# Altium schematic sheet 02-Insence_interface.SchDoc
size C; SheetNumber: 2
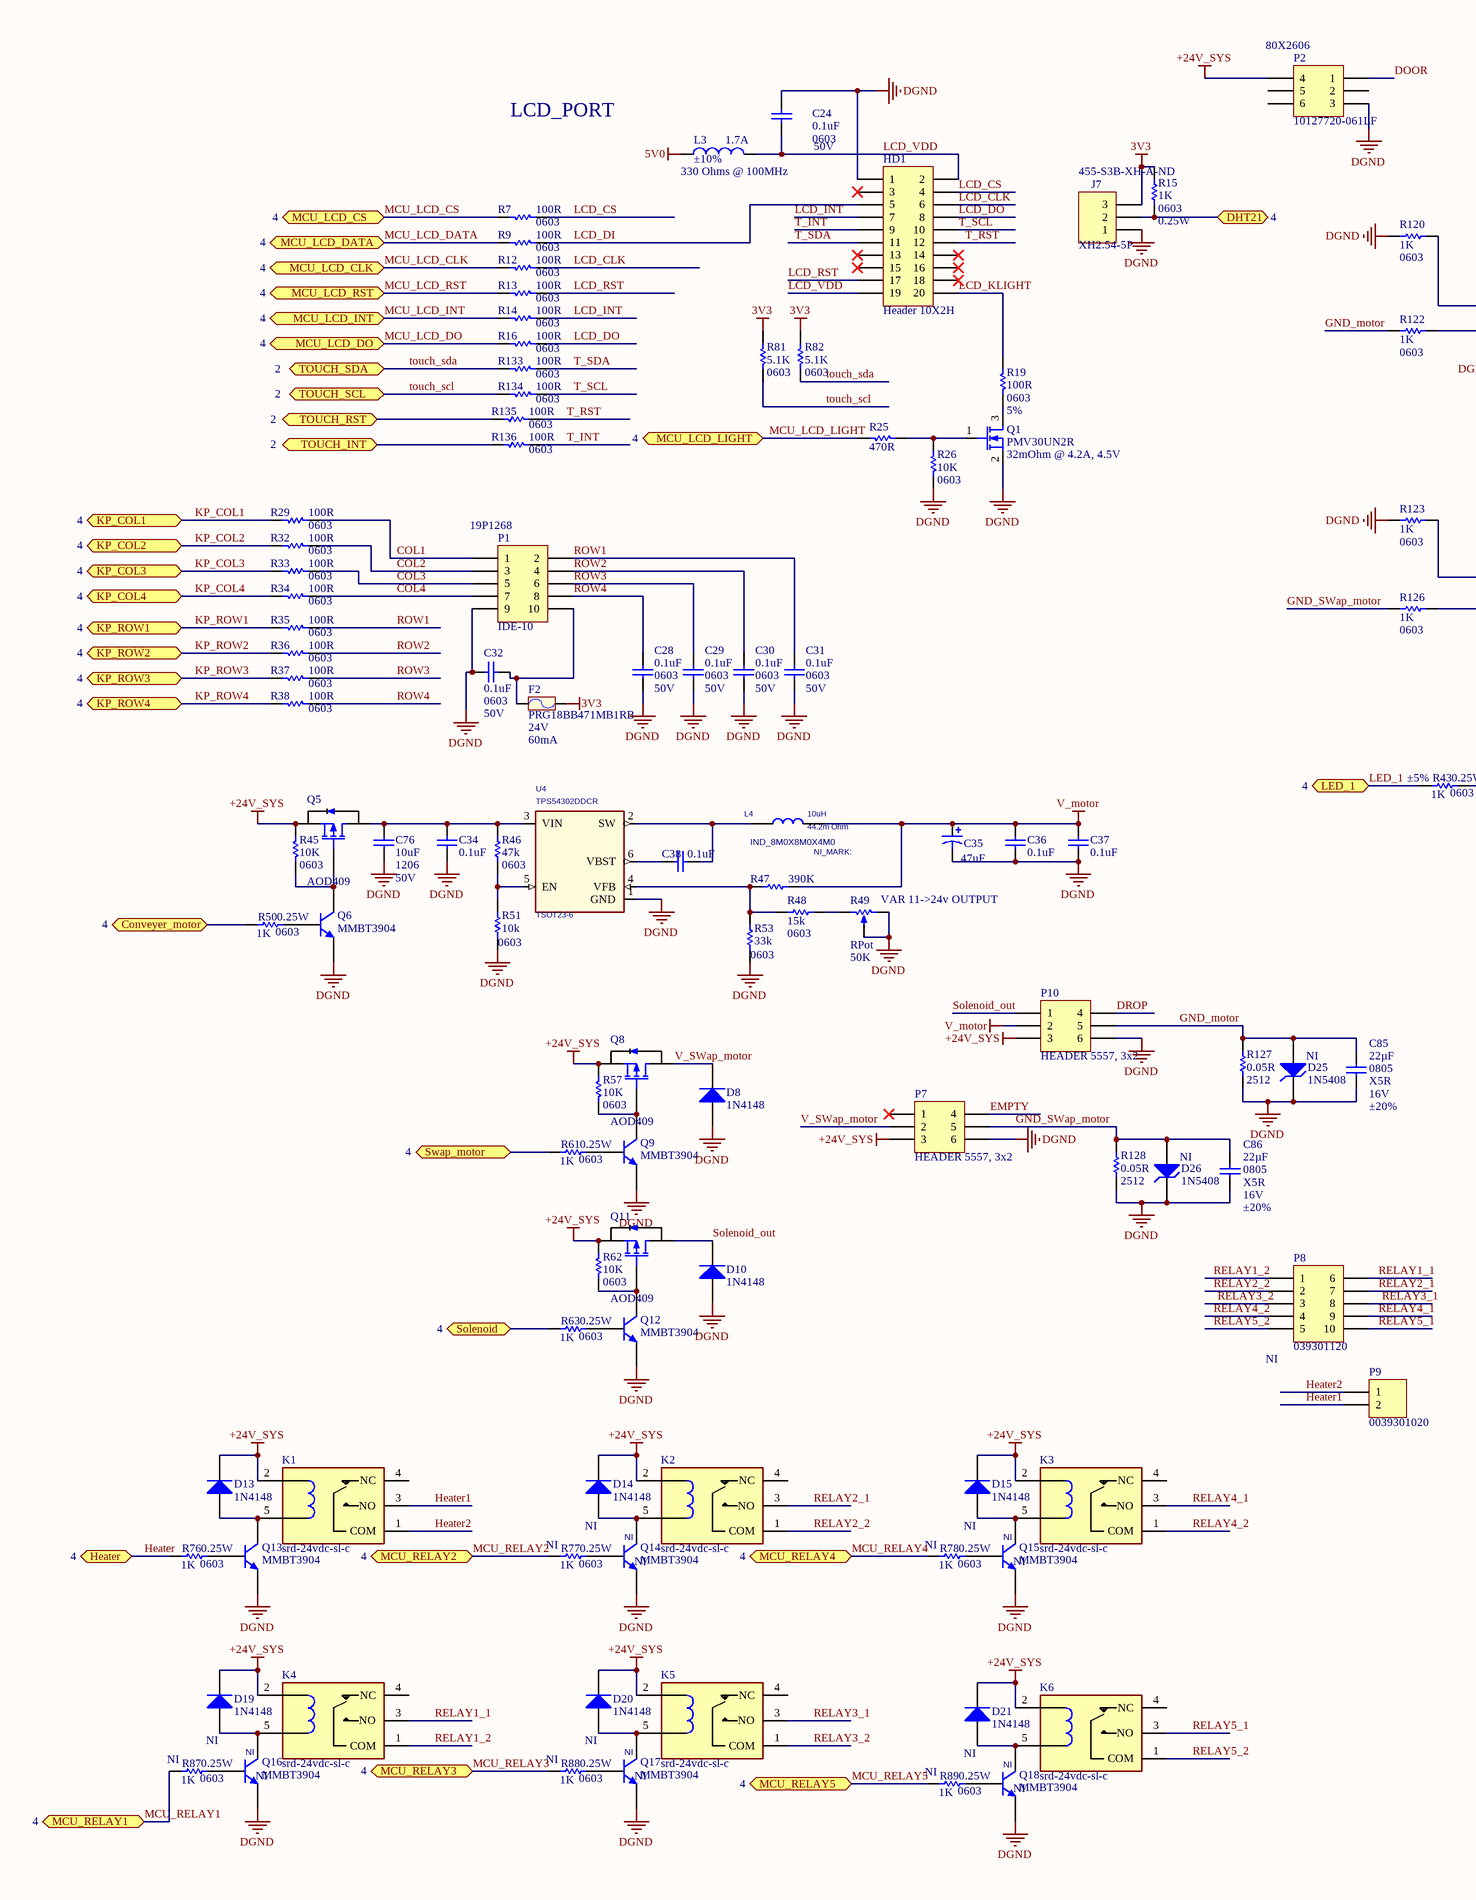
[diagram p0: 02-Insence_interface.SchDoc, left]
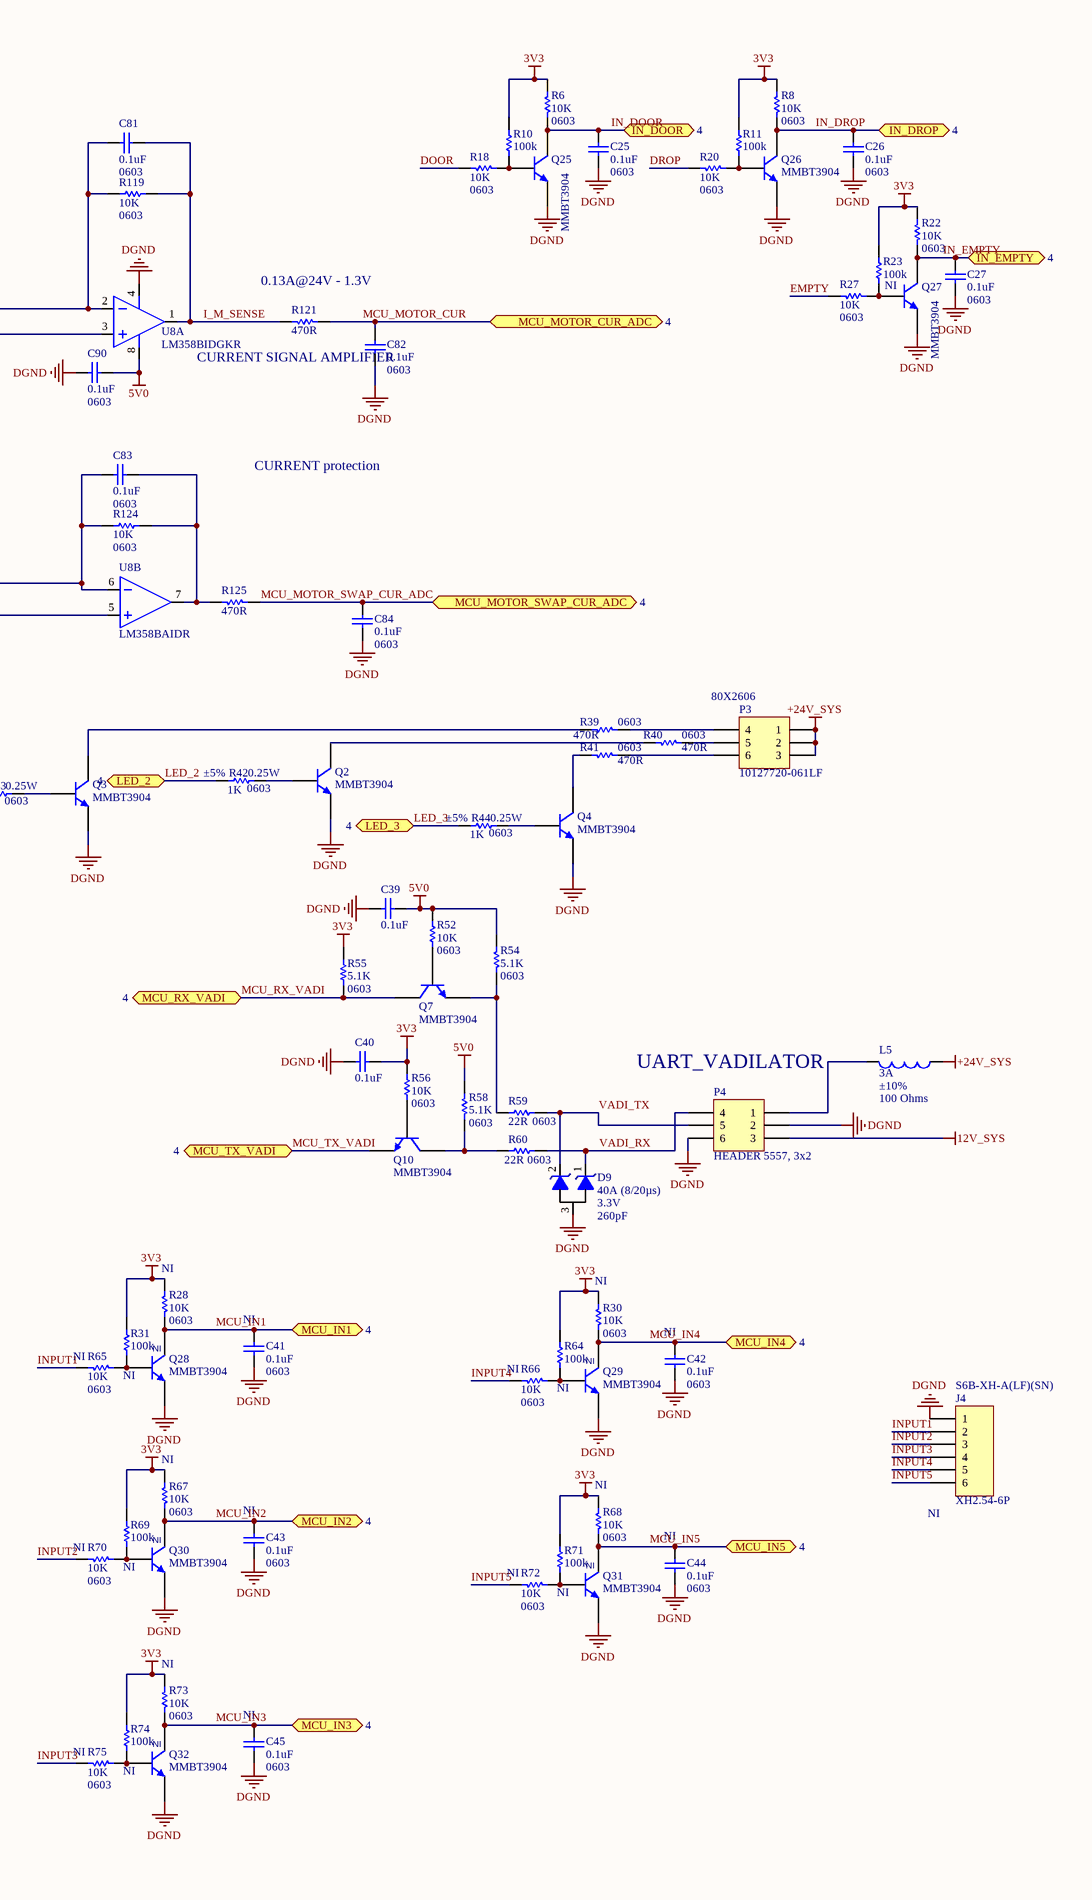
[diagram p1: 02-Insence_interface.SchDoc, right]

## Parts
C24  FOOTPRINT: 0603  Voltage: 50V  [CAP 0603]  (hidden comment: 0.1uF)
C25  FOOTPRINT: 0603  [CAP 0603]  (hidden comment: 0.1uF)
C26  FOOTPRINT: 0603  [CAP 0603]  (hidden comment: 0.1uF)
C27  FOOTPRINT: 0603  [CAP 0603]  (hidden comment: 0.1uF)
C28  FOOTPRINT: 0603  Voltage: 50V  [CAP 0603]  (hidden comment: 0.1uF)
C29  FOOTPRINT: 0603  Voltage: 50V  [CAP 0603]  (hidden comment: 0.1uF)
C30  FOOTPRINT: 0603  Voltage: 50V  [CAP 0603]  (hidden comment: 0.1uF)
C31  FOOTPRINT: 0603  Voltage: 50V  [CAP 0603]  (hidden comment: 0.1uF)
C32  FOOTPRINT: 0603  Voltage: 50V  [CAP 0603]  (hidden comment: 0.1uF)
C34  =Value: 0.1uF  [0805]  (hidden comment: Cap)
C35  47uF  [CAP ALUM SMD-D Package 6.3x5.4mm]
C36  =Value: 0.1uF  [0805]  (hidden comment: Cap)
C37  =Value: 0.1uF  [0805]  (hidden comment: Cap)
C38  =Value: 0.1uF  [cap 0603]  (hidden comment: Cap)
C39  0.1uF  [CAP 0603]
C40  0.1uF  [CAP 0603]
C41  FOOTPRINT: 0603  NI_MARK: NI  [CAP 0603]  (hidden comment: 0.1uF)
C42  FOOTPRINT: 0603  NI_MARK: NI  [CAP 0603]  (hidden comment: 0.1uF)
C43  FOOTPRINT: 0603  NI_MARK: NI  [CAP 0603]  (hidden comment: 0.1uF)
C44  FOOTPRINT: 0603  NI_MARK: NI  [CAP 0603]  (hidden comment: 0.1uF)
C45  FOOTPRINT: 0603  NI_MARK: NI  [CAP 0603]  (hidden comment: 0.1uF)
C76  FOOTPRINT: 1206  Voltage: 50V  [CAP 1206]  (hidden comment: 10uF)
C81  FOOTPRINT: 0603  [CAP 0603]  (hidden comment: 0.1uF)
C82  FOOTPRINT: 0603  [CAP 0603]  (hidden comment: 0.1uF)
C83  FOOTPRINT: 0603  [CAP 0603]  (hidden comment: 0.1uF)
C84  FOOTPRINT: 0603  [CAP 0603]  (hidden comment: 0.1uF)
C85  Package: 0805  Voltage: 16V  Tolerance: ±20%  Material: X5R  [CAP 0805]  (hidden comment: 22µF)
C86  Package: 0805  Voltage: 16V  Tolerance: ±20%  Material: X5R  [CAP 0805]  (hidden comment: 22µF)
C90  FOOTPRINT: 0603  [CAP 0603]  (hidden comment: 0.1uF)
D8  1N4148  [diode_1206]
D9  CURRENT: 40A (8/20µs)  VOLTAGE: 3.3V  Junction Capacitance: 260pF  [SOT-23-3]  (hidden comment: SM3.3H-TP)
D10  1N4148  [diode_1206]
D13  1N4148  [diode_1206]
D14  1N4148  NI_MARK: NI  [diode_1206]
D15  1N4148  NI_MARK: NI  [diode_1206]
D19  1N4148  NI_MARK: NI  [diode_1206]
D20  1N4148  NI_MARK: NI  [diode_1206]
D21  1N4148  NI_MARK: NI  [diode_1206]
D25  1N5408  NI_MARK: NI  [SMB]
D26  1N5408  NI_MARK: NI  [SMB]
F2  PRG18BB471MB1RB  Voltage - Rated: 24V  Current Rating (Amps): 60mA  [FB 0603]
HD1  Header 10X2H  [IDE_20-RA]
J4  XH2.54-6P  Supplier Part Number 1: S6B-XH-A(LF)(SN)  NI_MARK: NI  [XH2.54-6P-RA]
J7  XH2.54-5P  Supplier Part Number 1: 455-S3B-XH-A-ND  [XH2.54-3P-RA]
K1  srd-24vdc-sl-c  [srd24vdcslc]
K2  srd-24vdc-sl-c  NI_MARK: NI  [srd24vdcslc]
K3  srd-24vdc-sl-c  NI_MARK: NI  [srd24vdcslc]
K4  srd-24vdc-sl-c  NI_MARK: NI  [srd24vdcslc]
K5  srd-24vdc-sl-c  NI_MARK: NI  [srd24vdcslc]
K6  srd-24vdc-sl-c  NI_MARK: NI  [srd24vdcslc]
L3  Current: 1.7A  Tolerance: ±10%  [FB 0603]  (hidden comment: 330 Ohms @ 100MHz)
L4  10uH  PACKAGE: IND_8M0X8M0X4M0  DCR: 44.2m Ohm  [IND 8x8MM]
L5  value 100 Ohms  Current: 3A  Tolerance: ±10%  [FB 0603]  (hidden comment: MPZ1608S101ATAH0)
P1  IDE-10  Supplier Part Number 1: 19P1268  [IDE-10-RA]
P2  10127720-061LF  Supplier Part Number 1: 80X2606  [PHM-3x2H 3.0 - RA]
P3  10127720-061LF  Supplier Part Number 1: 80X2606  [PHM-3x2H 3.0 - RA]
P4  HEADER 5557, 3x2  [HDR2x3 4_2MM FEMALE TH RA]
P7  HEADER 5557, 3x2  [HDR2x3 4_2MM FEMALE TH RA]
P8  039301120  NI_MARK: NI  [HDR2x5 4_2MM FEMALE TH RA]
P9  0039301020  [HDR2x1 4_2MM FEMALE TH RA]
P10  HEADER 5557, 3x2  [HDR2x3 4_2MM FEMALE TH RA]
Q1  PMV30UN2R  RDSON: 32mOhm @ 4.2A, 4.5V  [SOT-23-3]
Q2  MMBT3904  [SOT-23]
Q3  MMBT3904  [SOT-23]
Q4  MMBT3904  [SOT-23]
Q5  AOD409  [TO-252]
Q6  MMBT3904  [SOT-23]
Q7  MMBT3904  [SOT-23]
Q8  AOD409  [TO-252]
Q9  MMBT3904  [SOT-23]
Q10  MMBT3904  [SOT-23]
Q11  AOD409  [TO-252]
Q12  MMBT3904  [SOT-23]
Q13  MMBT3904  [SOT-23]
Q14  MMBT3904  NI_MARK: NI  [SOT-23]
Q15  MMBT3904  NI_MARK: NI  [SOT-23]
Q16  MMBT3904  NI_MARK: NI  [SOT-23]
Q17  MMBT3904  NI_MARK: NI  [SOT-23]
Q18  MMBT3904  NI_MARK: NI  [SOT-23]
Q25  MMBT3904  [SOT-23]
Q26  MMBT3904  [SOT-23]
Q27  MMBT3904  [SOT-23]
Q28  MMBT3904  NI_MARK: NI  [SOT-23]
Q29  MMBT3904  NI_MARK: NI  [SOT-23]
Q30  MMBT3904  NI_MARK: NI  [SOT-23]
Q31  MMBT3904  NI_MARK: NI  [SOT-23]
Q32  MMBT3904  NI_MARK: NI  [SOT-23]
R6  PCB Footprint: 0603  [res 0603]  (hidden comment: 10K)
R7  PCB_ Footprint: 0603  [res 0603]  (hidden comment: 100R)
R8  PCB Footprint: 0603  [res 0603]  (hidden comment: 10K)
R9  PCB_ Footprint: 0603  [res 0603]  (hidden comment: 100R)
R10  value 100k  [RES 0603]  (hidden comment: 100k, 0603)
R11  value 100k  [RES 0603]  (hidden comment: 100k, 0603)
R12  PCB_ Footprint: 0603  [res 0603]  (hidden comment: 100R)
R13  PCB_ Footprint: 0603  [res 0603]  (hidden comment: 100R)
R14  PCB_ Footprint: 0603  [res 0603]  (hidden comment: 100R)
R15  PCB Footprint: 0603  Power: 0.25W  [res 0603]  (hidden comment: 1K)
R16  PCB_ Footprint: 0603  [res 0603]  (hidden comment: 100R)
R18  PCB Footprint: 0603  [res 0603]  (hidden comment: 10K)
R19  PCB_ Footprint: 0603  Tolerance: 5%  [res 0603]  (hidden comment: 100R)
R20  PCB Footprint: 0603  [res 0603]  (hidden comment: 10K)
R22  PCB Footprint: 0603  [res 0603]  (hidden comment: 10K)
R23  value 100k  Assembly: NI  [RES 0603]  (hidden comment: 100k, 0603)
R25  470R  [res 0603]
R26  PCB Footprint: 0603  [res 0603]  (hidden comment: 10K)
R27  PCB Footprint: 0603  [res 0603]  (hidden comment: 10K)
R28  NI_MARK: NI  PCB Footprint: 0603  [res 0603]  (hidden comment: 10K)
R29  PCB_ Footprint: 0603  [res 0603]  (hidden comment: 100R)
R30  NI_MARK: NI  PCB Footprint: 0603  [res 0603]  (hidden comment: 10K)
R31  value 100k  NI_MARK: NI  [RES 0603]  (hidden comment: 100k, 0603)
R32  PCB_ Footprint: 0603  [res 0603]  (hidden comment: 100R)
R33  PCB_ Footprint: 0603  [res 0603]  (hidden comment: 100R)
R34  PCB_ Footprint: 0603  [res 0603]  (hidden comment: 100R)
R35  PCB_ Footprint: 0603  [res 0603]  (hidden comment: 100R)
R36  PCB_ Footprint: 0603  [res 0603]  (hidden comment: 100R)
R37  PCB_ Footprint: 0603  [res 0603]  (hidden comment: 100R)
R38  PCB_ Footprint: 0603  [res 0603]  (hidden comment: 100R)
R39  PCB Footprint: 0603  [res 0603]  (hidden comment: 470R)
R40  PCB Footprint: 0603  [res 0603]  (hidden comment: 470R)
R41  PCB Footprint: 0603  [res 0603]  (hidden comment: 470R)
R42  PCB Footprint: 0603  Power: 0.25W  Tolerance: ±5%  [res 0603]  (hidden comment: 1K)
R43  PCB Footprint: 0603  Power: 0.25W  Tolerance: ±5%  [res 0603]  (hidden comment: 1K)
R44  PCB Footprint: 0603  Power: 0.25W  Tolerance: ±5%  [res 0603]  (hidden comment: 1K)
R45  PCB Footprint: 0603  [res 0603]  (hidden comment: 10K)
R46  value 47k  Footprint: 0603  [res 0603]  (hidden comment: Res1)
R47  value 390K  [res 0603]  (hidden comment: Res1)
R48  value 15k  Footprint: 0603  [res 0603]  (hidden comment: Res1)
R49  RPot  value 50K  [R_POT_RA]
R50  PCB Footprint: 0603  Power: 0.25W  [res 0603]  (hidden comment: 1K)
R51  value 10k  Footprint: 0603  [res 0603]  (hidden comment: Res1)
R52  PCB Footprint: 0603  [res 0603]  (hidden comment: 10K)
R53  value 33k  Footprint: 0603  [res 0603]  (hidden comment: Res1)
R54  PCB Footprint: 0603  [res 0603]  (hidden comment: 5.1K)
R55  PCB Footprint: 0603  [res 0603]  (hidden comment: 5.1K)
R56  PCB Footprint: 0603  [res 0603]  (hidden comment: 10K)
R57  PCB Footprint: 0603  [res 0603]  (hidden comment: 10K)
R58  PCB Footprint: 0603  [res 0603]  (hidden comment: 5.1K)
R59  PCB Footprint: 0603  [res 0603]  (hidden comment: 22R)
R60  PCB Footprint: 0603  [res 0603]  (hidden comment: 22R)
R61  PCB Footprint: 0603  Power: 0.25W  [res 0603]  (hidden comment: 1K)
R62  PCB Footprint: 0603  [res 0603]  (hidden comment: 10K)
R63  PCB Footprint: 0603  Power: 0.25W  [res 0603]  (hidden comment: 1K)
R64  value 100k  NI_MARK: NI  [RES 0603]  (hidden comment: 100k, 0603)
R65  NI_MARK: NI  PCB Footprint: 0603  [res 0603]  (hidden comment: 10K)
R66  NI_MARK: NI  PCB Footprint: 0603  [res 0603]  (hidden comment: 10K)
R67  NI_MARK: NI  PCB Footprint: 0603  [res 0603]  (hidden comment: 10K)
R68  NI_MARK: NI  PCB Footprint: 0603  [res 0603]  (hidden comment: 10K)
R69  value 100k  NI_MARK: NI  [RES 0603]  (hidden comment: 100k, 0603)
R70  NI_MARK: NI  PCB Footprint: 0603  [res 0603]  (hidden comment: 10K)
R71  value 100k  NI_MARK: NI  [RES 0603]  (hidden comment: 100k, 0603)
R72  NI_MARK: NI  PCB Footprint: 0603  [res 0603]  (hidden comment: 10K)
R73  NI_MARK: NI  PCB Footprint: 0603  [res 0603]  (hidden comment: 10K)
R74  value 100k  NI_MARK: NI  [RES 0603]  (hidden comment: 100k, 0603)
R75  NI_MARK: NI  PCB Footprint: 0603  [res 0603]  (hidden comment: 10K)
R76  PCB Footprint: 0603  Power: 0.25W  [res 0603]  (hidden comment: 1K)
R77  NI_MARK: NI  PCB Footprint: 0603  Power: 0.25W  [res 0603]  (hidden comment: 1K)
R78  NI_MARK: NI  PCB Footprint: 0603  Power: 0.25W  [res 0603]  (hidden comment: 1K)
R81  PCB Footprint: 0603  [res 0603]  (hidden comment: 5.1K)
R82  PCB Footprint: 0603  [res 0603]  (hidden comment: 5.1K)
R87  NI_MARK: NI  PCB Footprint: 0603  Power: 0.25W  [res 0603]  (hidden comment: 1K)
R88  NI_MARK: NI  PCB Footprint: 0603  Power: 0.25W  [res 0603]  (hidden comment: 1K)
R89  NI_MARK: NI  PCB Footprint: 0603  Power: 0.25W  [res 0603]  (hidden comment: 1K)
R119  PCB Footprint: 0603  [res 0603]  (hidden comment: 10K)
R120  PCB Footprint: 0603  [res 0603]  (hidden comment: 1K)
R121  470R  [res 0603]
R122  PCB Footprint: 0603  [res 0603]  (hidden comment: 1K)
R123  PCB Footprint: 0603  [res 0603]  (hidden comment: 1K)
R124  PCB Footprint: 0603  [res 0603]  (hidden comment: 10K)
R125  470R  [res 0603]
R126  PCB Footprint: 0603  [res 0603]  (hidden comment: 1K)
R127  value 0.05R  PCB Footprint: 2512  [res 2512]  (hidden comment: CR2512-F/-1R00ELF)
R128  value 0.05R  PCB Footprint: 2512  [res 2512]  (hidden comment: CR2512-F/-1R00ELF)
R133  PCB_ Footprint: 0603  [res 0603]  (hidden comment: 100R)
R134  PCB_ Footprint: 0603  [res 0603]  (hidden comment: 100R)
R135  PCB_ Footprint: 0603  [res 0603]  (hidden comment: 100R)
R136  PCB_ Footprint: 0603  [res 0603]  (hidden comment: 100R)
U4  TPS54302DDCR  PACKAGE: TSOT23-6  [SOT23-6]
U8  LM358BIDGKR  [SOIC-8]  (parts A,B of 2)

## Ports
Conveyer_motor (bidir, see 4), DHT21 (bidir, see 4), Heater (bidir, see 4), IN_DOOR (bidir, see 4), IN_DROP (bidir, see 4), IN_EMPTY (bidir, see 4), KP_COL1 (bidir, see 4), KP_COL2 (bidir, see 4), KP_COL3 (bidir, see 4), KP_COL4 (bidir, see 4), KP_ROW1 (bidir, see 4), KP_ROW2 (bidir, see 4), KP_ROW3 (bidir, see 4), KP_ROW4 (bidir, see 4), LED_1 (bidir, see 4), LED_2 (bidir, see 4), LED_3 (bidir, see 4), MCU_IN1 (bidir, see 4), MCU_IN2 (bidir, see 4), MCU_IN3 (bidir, see 4), MCU_IN4 (bidir, see 4), MCU_IN5 (bidir, see 4), MCU_LCD_CLK (bidir, see 4), MCU_LCD_CS (bidir, see 4), MCU_LCD_DATA (bidir, see 4), MCU_LCD_DO (bidir, see 4), MCU_LCD_INT (bidir, see 4), MCU_LCD_LIGHT (bidir, see 4), MCU_LCD_RST (bidir, see 4), MCU_MOTOR_CUR_ADC (bidir, see 4), MCU_MOTOR_SWAP_CUR_ADC (bidir, see 4), MCU_RELAY1 (bidir, see 4), MCU_RELAY2 (bidir, see 4), MCU_RELAY3 (bidir, see 4), MCU_RELAY4 (bidir, see 4), MCU_RELAY5 (bidir, see 4), MCU_RX_VADI (bidir, see 4), MCU_TX_VADI (bidir, see 4), Solenoid (bidir, see 4), Swap_motor (bidir, see 4), TOUCH_INT (bidir, see 2), TOUCH_RST (bidir, see 2), TOUCH_SCL (bidir, see 2), TOUCH_SDA (bidir, see 2)

## Nets
3V3: C40.2 F2.1 J7.3 R6.1 R8.1 R10.2 R11.2 R15.2 R22.1 R23.2 R28.1 R30.1 R31.2 R55.1 R56.1 R64.2 R67.1 R68.1 R69.2 R71.2 R73.1 R74.2 R81.1 R82.1
5V0: C39.1 C90.1 L3.1 R52.1 R54.1 R58.1 U8.8(+V)
12V_SYS: P4.3
+24V_SYS: D13.2(K) D14.2(K) D15.2(K) D19.2(K) D20.2(K) D21.2(K) K1.2(COIL_1) K2.2(COIL_1) K3.2(COIL_1) K4.2(COIL_1) K5.2(COIL_1) K6.2(COIL_1) L5.1 P2.4 P3.1 P3.2 P3.3 P7.3 P10.3 Q5.3(S) Q8.3(S) Q11.3(S) R45.1 R57.1 R62.1
DGND: C24.1 C25.1 C26.1 C27.1 C28.1 C29.1 C30.1 C31.1 C32.1 C34.1 C35.2 C36.1 C37.1 C39.2 C40.1 C41.1 C42.1 C43.1 C44.1 C45.1 C76.1 C82.1 C84.1 C85.2 C86.2 C90.2 D8.1(A) D9.3(A) D10.1(A) D25.2(K) D26.2(K) HD1.1 J4.1 J7.1 P1.9 P2.3 P4.2 P4.6 P7.6 P10.6 Q1.2(S) Q2.2(E) Q3.2(E) Q4.2(E) Q6.2(E) Q9.2(E) Q12.2(E) Q13.2(E) Q14.2(E) Q15.2(E) Q16.2(E) Q17.2(E) Q18.2(E) Q25.2(E) Q26.2(E) Q27.2(E) Q28.2(E) Q29.2(E) Q30.2(E) Q31.2(E) Q32.2(E) R26.2 R49.1(TOP) R49.3(TAP) R51.2 R53.2 R120.2 R123.2 R127.2 R128.2 U4.1(GND) U8.4(-V)
V_motor: C35.1 C36.2 C37.2 L4.2(B) P10.2 R47.2
COL1: P1.1 R29.2
COL2: P1.3 R32.2
COL3: P1.5 R33.2
COL4: P1.7 R34.2
Conveyer_motor: R50.2 ; port Conveyer_motor
DHT21: J7.2 R15.1 ; port DHT21
DOOR: P2.1 R18.1
DROP: P10.4 R20.1
EMPTY: P7.4 R27.1
GND_motor: C85.1 D25.1(A) P10.5 R122.2 R127.1
GND_SWap_motor: C86.1 D26.1(A) P7.5 R126.2 R128.1
Heater: R76.2 ; port Heater
Heater1: K1.3(NO) P9.2
Heater2: K1.1(COM) P9.1
I_M_SENSE: C81.1 R119.2 R121.1 U8.1(OUT)
IN_DOOR: C25.2 Q25.3(C) R6.2 ; port IN_DOOR
IN_DROP: C26.2 Q26.3(C) R8.2 ; port IN_DROP
IN_EMPTY: C27.2 Q27.3(C) R22.2 ; port IN_EMPTY
INPUT1: J4.2 R65.1
INPUT2: J4.3 R70.1
INPUT3: J4.4 R75.1
INPUT4: J4.5 R66.1
INPUT5: J4.6 R72.1
KP_COL1: R29.1 ; port KP_COL1
KP_COL2: R32.1 ; port KP_COL2
KP_COL3: R33.1 ; port KP_COL3
KP_COL4: R34.1 ; port KP_COL4
KP_ROW1: R35.1 ; port KP_ROW1
KP_ROW2: R36.1 ; port KP_ROW2
KP_ROW3: R37.1 ; port KP_ROW3
KP_ROW4: R38.1 ; port KP_ROW4
LCD_CLK: HD1.6 R12.2
LCD_CS: HD1.4 R7.2
LCD_DI: HD1.5 R9.2
LCD_DO: HD1.8 R16.2
LCD_INT: HD1.7 R14.2
LCD_KLIGHT: HD1.20 R19.1
LCD_RST: HD1.17 R13.2
LCD_VDD: C24.2 HD1.2 HD1.19 L3.2
LED_1: R43.2 ; port LED_1
LED_2: R42.2 ; port LED_2
LED_3: R44.2 ; port LED_3
MCU_IN1: C41.2 Q28.3(C) R28.2 ; port MCU_IN1
MCU_IN2: C43.2 Q30.3(C) R67.2 ; port MCU_IN2
MCU_IN3: C45.2 Q32.3(C) R73.2 ; port MCU_IN3
MCU_IN4: C42.2 Q29.3(C) R30.2 ; port MCU_IN4
MCU_IN5: C44.2 Q31.3(C) R68.2 ; port MCU_IN5
MCU_LCD_CLK: R12.1 ; port MCU_LCD_CLK
MCU_LCD_CS: R7.1 ; port MCU_LCD_CS
MCU_LCD_DATA: R9.1 ; port MCU_LCD_DATA
MCU_LCD_DO: R16.1 ; port MCU_LCD_DO
MCU_LCD_INT: R14.1 ; port MCU_LCD_INT
MCU_LCD_LIGHT: R25.2 ; port MCU_LCD_LIGHT
MCU_LCD_RST: R13.1 ; port MCU_LCD_RST
MCU_MOTOR_CUR: C82.2 R121.2 ; port MCU_MOTOR_CUR_ADC
MCU_MOTOR_SWAP_CUR_ADC: C84.2 R125.1 ; port MCU_MOTOR_SWAP_CUR_ADC
MCU_RELAY1: R87.2 ; port MCU_RELAY1
MCU_RELAY2: R77.2 ; port MCU_RELAY2
MCU_RELAY3: R88.2 ; port MCU_RELAY3
MCU_RELAY4: R78.2 ; port MCU_RELAY4
MCU_RELAY5: R89.2 ; port MCU_RELAY5
MCU_RX_VADI: Q7.3(C) R55.2 ; port MCU_RX_VADI
MCU_TX_VADI: Q10.2(E) ; port MCU_TX_VADI
RELAY1_1: K4.3(NO) P8.6
RELAY1_2: K4.1(COM) P8.1
RELAY2_1: K2.3(NO) P8.7
RELAY2_2: K2.1(COM) P8.2
RELAY3_1: K5.3(NO) P8.8
RELAY3_2: K5.1(COM) P8.3
RELAY4_1: K3.3(NO) P8.9
RELAY4_2: K3.1(COM) P8.4
RELAY5_1: K6.3(NO) P8.10
RELAY5_2: K6.1(COM) P8.5
ROW1: C31.2 P1.2 R35.2
ROW2: C30.2 P1.4 R36.2
ROW3: C29.2 P1.6 R37.2
ROW4: C28.2 P1.8 R38.2
Solenoid: R63.2 ; port Solenoid
Solenoid_out: D10.2(K) P10.1 Q11.2(D)
Swap_motor: R61.2 ; port Swap_motor
T_INT: HD1.9 R136.2
T_RST: HD1.12 R135.2
T_SCL: HD1.10 R134.2
T_SDA: HD1.11 R133.2
TOUCH_INT: R136.1 ; port TOUCH_INT
TOUCH_RST: R135.1 ; port TOUCH_RST
touch_scl: R81.2 R134.1 ; port TOUCH_SCL
touch_sda: R82.2 R133.1 ; port TOUCH_SDA
V_SWap_motor: D8.2(K) P7.2 Q8.2(D)
VADI_RX: D9.1(K) P4.4 R60.2
VADI_TX: D9.2(K) P4.5 R59.2
NetC32_2: C32.2 F2.2 P1.10
NetC34_2: C34.2 C76.2 Q5.2(D) R46.2 U4.3(VIN)
NetC38_1: C38.1 U4.6(VBST)
NetC38_2: C38.2 L4.1(A) U4.2(SW)
NetC81_2: C81.2 R119.1 R120.1 U8.2(IN-)
NetC83_1: C83.1 R124.2 R125.2 U8.7(OUT)
NetC83_2: C83.2 R123.1 R124.1 U8.6(IN-)
NetD13_1: D13.1(A) K1.5(COIL_2) Q13.3(C)
NetD14_1: D14.1(A) K2.5(COIL_2) Q14.3(C)
NetD15_1: D15.1(A) K3.5(COIL_2) Q15.3(C)
NetD19_1: D19.1(A) K4.5(COIL_2) Q16.3(C)
NetD20_1: D20.1(A) K5.5(COIL_2) Q17.3(C)
NetD21_1: D21.1(A) K6.5(COIL_2) Q18.3(C)
NetL5_2: L5.2 P4.1
NetP3_4: P3.4 R39.1
NetP3_5: P3.5 R40.1
NetP3_6: P3.6 R41.1
NetQ1_1: Q1.1(G) R25.1 R26.1
NetQ1_3: Q1.3(D) R19.2
NetQ2_1: Q2.1(B) R42.1
NetQ2_3: Q2.3(C) R40.2
NetQ3_1: Q3.1(B) R43.1
NetQ3_3: Q3.3(C) R39.2
NetQ4_1: Q4.1(B) R44.1
NetQ4_3: Q4.3(C) R41.2
NetQ5_1: Q5.1(G) Q6.3(C) R45.2
NetQ6_1: Q6.1(B) R50.1
NetQ7_1: Q7.1(B) R52.2
NetQ7_2: Q7.2(E) R54.2 R59.1
NetQ8_1: Q8.1(G) Q9.3(C) R57.2
NetQ9_1: Q9.1(B) R61.1
NetQ10_1: Q10.1(B) R56.2
NetQ10_3: Q10.3(C) R58.2 R60.1
NetQ11_1: Q11.1(G) Q12.3(C) R62.2
NetQ12_1: Q12.1(B) R63.1
NetQ13_1: Q13.1(B) R76.1
NetQ14_1: Q14.1(B) R77.1
NetQ15_1: Q15.1(B) R78.1
NetQ16_1: Q16.1(B) R87.1
NetQ17_1: Q17.1(B) R88.1
NetQ18_1: Q18.1(B) R89.1
NetQ25_1: Q25.1(B) R10.1 R18.2
NetQ26_1: Q26.1(B) R11.1 R20.2
NetQ27_1: Q27.1(B) R23.1 R27.2
NetQ28_1: Q28.1(B) R31.1 R65.2
NetQ29_1: Q29.1(B) R64.1 R66.2
NetQ30_1: Q30.1(B) R69.1 R70.2
NetQ31_1: Q31.1(B) R71.1 R72.2
NetQ32_1: Q32.1(B) R74.1 R75.2
NetR46_1: R46.1 R51.1 U4.5(EN)
NetR47_1: R47.1 R48.1 R53.1 U4.4(VFB)
NetR48_2: R48.2 R49.2(BOT)
NetR122_1: R122.1 U8.3(IN+)
NetR126_1: R126.1 U8.5(IN+)

Not connected (* = marked no-connect by the designer): HD1 3* 13* 14* 15* 16* 18*; K1 4(NC); K2 4(NC); K3 4(NC); K4 4(NC); K5 4(NC); K6 4(NC); P2 2 5 6; P7 1*

## Notes on the sheet
- LCD_PORT
- 0.13A@24V - 1.3V
- (near C82) CURRENT SIGNAL AMPLIFIER
- CURRENT protection
- (near R49) VAR 11->24v OUTPUT
- (near P4) UART_VADILATOR

## Library data of the parts
C24 C28-C32 = Cap_0.1uF: CAP CER 0.1UF 50V X7R 0603; MANUFACTURER1_PART#: CL10B104KB8NNNC; MANU1: Samsung Electro-Mechanics; PROC: SM; Unit: PCS; Tolerance: ±10%; CATEGORY: CAP-CER; VALUE: 0.1uF; Material: X7R; MANUFACTURER1: Samsung Electro-Mechanics
C25-C27 C41-C45 C81-C84 C90 = Cap: CAP CER 0.1UF 50V X7R 0603; MANUFACTURER1_PART#: CL10B104KB8NNNC; MANUFACTURER2_PART#: M0603X104K050TAX; MANUFACTURER1: Samsung Electro-Mechanics; Unit: PCS; PACKING: Tape & Reel (TR); Process Type: SM; Tolerance: ±10%; CATEGORY: CAP-CER; VALUE: 0.1uF; Material: X7R; Voltage: 50V; PCB FOOTPRINT: 0603; MANUFACTURER2: UWA
C34 C38 = Cap: CAP CER 0.1UF 50V X7R 0603; MANUFACTURER1: Samsung Electro-Mechanics; MANUFACTURER1_PART#: CL10B104KB8NNNC; Published: 8-Jun-2000; LatestRevisionDate: 17-Jul-2002; LatestRevisionNote: Re-released for DXP Platform.; PackageReference: RAD-0.3; Publisher: Altium Limited; PackageDescription: Radial Cap, Thru-Hole; 2 Leads; 0.3 in Pin Spacing
C35 = Cap TANTAN 47UF35V2917: CAP ALUM 47UF 20% 35V SMD; MANUFACTURER1_PART#: UUR1V470MCL6GS; MANUFACTURER1: Nichicon; MANUFACTURER2_PART#: EDK476M035A9GAA; TEMP: 0-85; DIA: 6.3mm; Value: 47uF; MANUFACTURER2: KEMET; LOH_CODE: *; VOLTAGE: 35V; TOLERANCE: 20%; CATEGORY: CAP-POL-SMD
C36 C37 = Cap: cap,0805,0.1uF,50V; Published: 8-Jun-2000; LatestRevisionDate: 17-Jul-2002; LatestRevisionNote: Re-released for DXP Platform.; PackageReference: RAD-0.3; Publisher: Altium Limited; PackageDescription: Radial Cap, Thru-Hole; 2 Leads; 0.3 in Pin Spacing
C39 C40 = Cap: CAP CER 0.1UF 50V X7R 0603; MANUFACTURER1_PART#: CL10B104KB8NNNC; MANUFACTURER2_PART#: M0603X104K050TAX; MANUFACTURER1: Samsung Electro-Mechanics; Unit: PCS; PACKING: Tape & Reel (TR); PCB FOOTPRINT: 0603; Process Type: SM; Tolerance: ±10%; CATEGORY: CAP-CER; VALUE: 0.1uF; FOOTPRINT: 0603; Material: X7R; Voltage: 50V; MANUFACTURER2: UWA
C76 = Cap: CAP CER 10UF 50V X5R 1206; MANUFACTURER1: Samsung Electro-Mechanics; MANUFACTURER1_PART#: CL31A106MBHNNNE; MANUFACTURER1: SS; Unit: PCS; Material: X7R; PACKING: Tape & Reel (TR); Process Type: SM; Tolerance: ±10%; CATEGORY: CAP-CER; VALUE: 10uF; PCB FOOTPRINT: 1206
C85 C86 = Cap-NP-100: CAP CER 22UF 16V X5R 0805; MANUFACTURER1: Samsung; MANUFACTURER1_PART#: CL21A226MOCLRNC; MANUFACTURER2_PART#: LMK212BBJ226MG-T; PACKING: Tape & Reel (TR); Process Type: SM; Unit: PCS; Value: 22µF; CATEGORY: CAP_CER; DESCCRIPTION: CAP CER 22UF 16V X5R 0805; MANUFACTURER2: Taiyo Yuden; PCB Footprint: 0805
D8 D10 D13-D15 D19-D21 = Diode: DIODE GP 100V 300MA SOD123 10K; MANUFACTURER1: Diodes Incorporated; MANUFACTURER1_PART#: 1N4148WQ-13-F; Published: 8-Jun-2000; LatestRevisionDate: 17-Jul-2002; LatestRevisionNote: Re-released for DXP Platform.; PackageVersion: Sep-1996; PackageReference: SMC; Publisher: Altium Limited; PackageDescription: DO-214-AB/SMC; 2 C-Bend Leads; Body 7.9 x 5.9 mm, inc. leads (LxW); Code_JEDEC: DO-214-AB
D9 = TVS_DUAL_3V3_SOT23: 3.3V, ESD PROTECTION DEVICES, SO; MANUFACTURER2_PART#: GSOT03C-E3-08; MANUFACTURER1: Micro Commercial Co; POWER: 500W; Category: TVS; MANUFACTURER1_PART#: SM3.3H-TP; MANUFACTURER2: Vishay; Value: SM3.3H-TP; LOH_CODE: *
D25 D26 = Diode Zener: TVS DIODE 30V 50.82V DO214AB; MANUFACTURER1: Vishay; MANUFACTURER1_PART#: S3MHE3_A/I; LOH_Code: *; Category: DIODE; Value: 1N5408; MANUFACTURER2: *; MANUFACTURER2_PART#: *; Packaging: *
F2 = 0875.800MXEP: PTC RESET FUSE 24V 10MA 0603; MANUFACTURER1: Murata Electronics; PROCESS_TYPE: MA; Unit: PCS; Response Time: Slow Blow; Breaking Capacity @ Rated Voltage: 0.06A; Melting I²t: 0.919; Value: CLA1683; DC Cold Resistance: 0.116 Ohms; CATEGORY: FUSE; MANUFACTURER1_PART#: PRG18BB471MB1RB; Package / Case: 0603
HD1 = Header 10X2H: CONN HEADER R/A 20POS 2.54MM; MANUFACTURER1: Wurth Elektronik; MANUFACTURER1_PART#: 61202021721; LatestRevisionDate: 17-Jul-2002; LatestRevisionNote: Re-released for DXP Platform.; Publisher: Altium Limited
J4 = Header 6: CONN HEADER R/A 6POS 2.5MM; MANUFACTURER1: JST Sales America Inc.; MANUFACTURER1_PART#: S6B-XH-A; LatestRevisionDate: 17-Jul-2002; LatestRevisionNote: Re-released for DXP Platform.; Publisher: Altium Limited; Supplier 1: Arrow Electronics
J7 = Header 3: CONN HEADER R/A 3POS 2.5MM; MANUFACTURER1: JST Sales America Inc.; MANUFACTURER1_PART#: S3B-XH-A; LatestRevisionDate: 17-Jul-2002; LatestRevisionNote: Re-released for DXP Platform.; Publisher: Altium Limited; Supplier 1: Digikey
K1-K6 = srd-24vdc-sl-c: Relay 24V 10A 5 PIN; Manufacturer_Name: EAGLE; MANUFACTURER1: SONGLE; Datasheet Link: https://pdf1.alldatasheet.com/datasheet-pdf/view/1132032/SONGLERELAY/SRD-24VDC-SL-C.html; Height: 15.3mm; Manufacturer_Part_Number: srd-24vdc-sl-c; MANUFACTURER1_PART#: srd-24vdc-sl-c
L3 = inductor 2.2uF: FERRITE BEAD 330 OHM 0603 1LN; MANUFACTURER1: TDK Corporation; MANUFACTURER1_PART#: MPZ1608S331ATA00; MANUFACTURER2_PART#: BLM18KG331SN1D; PACKING: Tape & Reel (TR); PCB Footprint: 0603; Process Type: SM; Unit: PCS; Category: Inductor; DESCRIPTION_: FERRITE BEAD 330 OHM 0603 1LN; MANUFACTURER2: Murata Electronics; Value: 330 Ohms @ 100MHz
L4 = IND_10uH_3.1A_44.2mOhm_8MX8MX4M: IND-SMD;10uH,20%,8x8x4mm,3.1A,44.2mOHM; MFG1_PART#: NR8040T100M; DISTR1_PART#: 587-2001-2-ND; PSpice Template: L^@REFDES %A %B @ MODEL @VALUE; BY: VINFAST_RD; MFG1: TAIYO YUDEN; PROCESS: SM; DISTR1: DIGIKEY; Current: 3.1A; Tolerance: 20%; Category: INDUCTOR; TYPE: IND-SMD; VFCODE: NR8040T100M; Tolerance6: 20%; MANUFACTURER1: Taiyo Yuden; MANUFACTURER1_PART#: NR8040T100M
L5 = inductor 2.2uF: FERRITE BEAD 100 OHM 0603 1LN; MANUFACTURER1: TDK Corporation; MANUFACTURER2_PART#: BLM18KG101TN1D; PACKING: Tape & Reel (TR); PCB Footprint: 0603; Process Type: SM; Unit: PCS; Category: Inductor; MANUFACTURER1_PART#: MPZ1608S101ATAH0; MANUFACTURER2: Murata Electronics
P1 = IDE10: CONN HEADER R/A 10POS 2.54MM; MANUFACTURER1: Wurth Elektronik; MANUFACTURER1_PART#: 61201021721; Category: CONNECTOR; Value: IDE-10; PITCH: 2.54mm; Supplier 1: Newark
P2 P3 = Header 3X2A: Header, 3-Pin, Dual row; MANUFACTURER1: Amphenol ICC (FCI); LatestRevisionDate: 17-Jul-2002; LatestRevisionNote: Re-released for DXP Platform.; Publisher: Altium Limited; Supplier 1: Avnet; MANUFACTURER1_PART#: 10127720-061LF
P4 P7 P10 = Header 3X2A: CONN HEADER R/A 6POS 4.2MM; MANUFACTURER1: Molex; MANUFACTURER1_PART#: 0039301060; LatestRevisionDate: 17-Jul-2002; LatestRevisionNote: Re-released for DXP Platform.; Publisher: Altium Limited; Supplier 1: Mouser; Supplier Part Number 1: 538-39-28-1063
P8 = Header 5X2A: CONN HEADER R/A 10POS 4.2MM; MANUFACTURER1: Molex; LatestRevisionDate: 17-Jul-2002; LatestRevisionNote: Re-released for DXP Platform.; Publisher: Altium Limited; MANUFACTURER1_PART#: 039301120
P9 = Header 2H: Header, 2-Pin, Right Angle; MANUFACTURER1: Molex; LatestRevisionDate: 17-Jul-2002; LatestRevisionNote: Re-released for DXP Platform.; Publisher: Altium Limited; MANUFACTURER1_PART#: 0039301020
Q1 = Si2302DS: MOSFET N-CH 20V 4.2A SOT23; MANUFACTURER1: Nexperia USA Inc.; Current - Continuous Drain: 4.2A (Ta); VGH: 1.2V, 4.5V; LOH_Code: *; Category: FET; Value: PMV30UN2R; MANUFACTURER1_PART#: PMV30UN2R; MANUFACTURER2: *; MANUFACTURER2_PART#: *
Q2-Q4 Q6 Q7 Q9 Q10 Q12-Q18 Q25-Q32 = NPN: NPN 200mA 40V 350mW SOT-23 Transistors; MANUFACTURER1: Guangdong Hottech; PROCESS_TYPE: SM; PACKAGE: SOT23; Category: TRANSISTOR; MANUFACTURER2: HT(Shenzhen Jinyu Semicon); MANUFACTURER2_PART#: MMBT3904; MANUFACTURER1_PART#: MMBT3904; Value: MMBT3904
Q5 Q8 Q11 = MOSFET-P: MOSFET P-CH 60V 26A TO252; MANUFACTURER1: Alpha & Omega Semiconductor Inc.; Published: 8-Jun-2000; LatestRevisionDate: 17-Jul-2002; LatestRevisionNote: Re-released for DXP Platform.; PackageVersion: 1995/1996; PackageReference: E3; Publisher: Altium Limited; PackageDescription: TO, Flat Index; 3 In-Line, Axial Leads; Body Dia. 4.6mm; Lead Dia. 0.5 mm (max); MANUFACTURER1_PART#: AOD409
R6 R8 R18 R20 R22 R26-R28 R30 R45 R52 R56 R57 R62 R65-R68 R70 R72 R73 R75 = Res0.3: RES SMD,10K OHM 5% 1/10W 0603; MANUFACTURER1: Stackpole Electronics Inc; MANUFACTURER1_PART#: RMCF0603JT10K0; MANUFACTURER2_PART#: R0603J10KKDX; PACKING: Tape & Reel (TR); Process Type: SM; Unit: PCS; Power: 0.25W; Value: 10K; CATEGORY: RES-SMD; MANUFACTURER2: UWA; Tolerance: ±5%
R7 R9 R12-R14 R16 R19 R29 R32-R38 R133-R136 = RES 120 OHM 5% 1/10W 0603: RES 100 OHM 5% 1/10W 0603; MANUFACTURER1: Stackpole; MANUFACTURER1_PART#: RMCF0603JG100R; PROC: SM; Unit: PCS; CATEGORY: RES-SMD; VALUE: 100R; FOOTPRINT: 0603
R10 R11 R23 R31 R64 R69 R71 R74 = Res1: RES 100K OHM 1% 1/10W 0603; MANUFACTURER1: Stackpole Electronics Inc; MANUFACTURER1_PART#: RMCF0603FT100K; Published: 8-Jun-2000; LatestRevisionDate: 17-Jul-2002; LatestRevisionNote: Re-released for DXP Platform.; PackageReference: AXIAL-0.3; Publisher: Altium Limited; PackageDescription: Axial Device, Thru-Hole; 2 Leads; 0.3 in Pin Spacing
R15 R42-R44 R50 R61 R63 R76-R78 R87-R89 R120 R122 R123 R126 = Res0.3: RES SMD,1K OHM,5%,1/10W,0603; MANUFACTURER1: Stackpole Electronics Inc; MANUFACTURER1_PART#: RMCF06031K00JNEAC; MANUFACTURER2_PART#: R0603J1KTG; DESCCRIPTION: RES SMD 1K OHM 5% 1/10W 0603; PACKING: Tape & Reel (TR); Process Type: SM; Unit: PCS; LOH_Code: 140100083; Value: 1K; CATEGORY: RES SMD; MANUFACTURER2: UWA
R25 R121 R125 = Res0.3: RES SMD, 470 OHM 5% 1/8W 0603; MANUFACTURER1: KOA Speer Electronics, Inc.; MANUFACTURER1_PART#: RK73B1JTTD471J; MANUFACTURER2_PART#: RMCF0603JT470R; PACKING: Tape & Reel (TR); PCB Footprint: 0603; Process Type: SM; Unit: PCS; Power: 0.25W; Value: 470R; CATEGORY: RES SMD; MANUFACTURER2: Stackpole; Tolerance: ±5%
R39-R41 = Res0.3: RES SMD, 470 OHM 5% 1/8W 0603; MANUFACTURER1: KOA Speer Electronics, Inc.; MANUFACTURER1_PART#: RK73B1JTTD471J; MANUFACTURER2_PART#: RMCF0603JT470R; PACKING: Tape & Reel (TR); Process Type: SM; Unit: PCS; Power: 0.25W; Value: 470R; CATEGORY: RES SMD; MANUFACTURER2: Stackpole; Tolerance: ±5%
R46 = Res1: RES 47K OHM 5% 1/10W 0603; MANUFACTURER1: Stackpole Electronics Inc; MANUFACTURER1_PART#: RMCF0603JT47K0; Published: 8-Jun-2000; LatestRevisionDate: 17-Jul-2002; LatestRevisionNote: Re-released for DXP Platform.; PackageReference: AXIAL-0.3; Publisher: Altium Limited; PackageDescription: Axial Device, Thru-Hole; 2 Leads; 0.3 in Pin Spacing
R47 = Res1: RES 390K OHM 1% 1/10W 0603; MANUFACTURER1: YAGEO; MANUFACTURER1_PART#: RC0603FR-07390KL; Published: 8-Jun-2000; LatestRevisionDate: 17-Jul-2002; LatestRevisionNote: Re-released for DXP Platform.; PackageReference: AXIAL-0.3; Publisher: Altium Limited; PackageDescription: Axial Device, Thru-Hole; 2 Leads; 0.3 in Pin Spacing
R48 = Res1: RES SMD,15K OHM 5% 1/10W 0603; MANUFACTURER1: Stackpole Electronics Inc; MANUFACTURER1_PART#: RMCF0603JT15K0; Published: 8-Jun-2000; LatestRevisionDate: 17-Jul-2002; LatestRevisionNote: Re-released for DXP Platform.; PackageReference: AXIAL-0.3; Publisher: Altium Limited; PackageDescription: Axial Device, Thru-Hole; 2 Leads; 0.3 in Pin Spacing
R49 = RPot: VR 3006P-1-503; Sim Note: Enter the Resistance value and the set point into parameter fields.; Set Position: 0.5; Published: 8-Jun-2000; LatestRevisionDate: 17-Jul-2002; LatestRevisionNote: Re-released for DXP Platform.; PackageReference: VR5; Publisher: Altium Limited; PackageDescription: Variable Resistor, Thru-Hole; 3 Leads; MANUFACTURER1: https://banlinhkien.com/bien-tro-50k-3006p503-p6651084.html; MANUFACTURER1_PART#: 3006P-1-503
R51 = Res1: RES SMD,10K OHM 5% 1/10W 0603; MANUFACTURER1: Stackpole Electronics Inc; MANUFACTURER1_PART#: RMCF0603JT10K0; Published: 8-Jun-2000; LatestRevisionDate: 17-Jul-2002; LatestRevisionNote: Re-released for DXP Platform.; PackageReference: AXIAL-0.3; Publisher: Altium Limited; PackageDescription: Axial Device, Thru-Hole; 2 Leads; 0.3 in Pin Spacing
R53 = Res1: RES SMD,33K OHM 5% 1/10W 0603; MANUFACTURER1: Stackpole Electronics Inc; MANUFACTURER1_PART#: RMCF0603JT33K0; Published: 8-Jun-2000; LatestRevisionDate: 17-Jul-2002; LatestRevisionNote: Re-released for DXP Platform.; PackageReference: AXIAL-0.3; Publisher: Altium Limited; PackageDescription: Axial Device, Thru-Hole; 2 Leads; 0.3 in Pin Spacing
R54 R55 R58 R81 R82 = Res0.3: RES SMD 5.1K OHM 1% 1/10W 0603; MANUFACTURER1: Yageo; MANUFACTURER1_PART#: RC0603FR-075K1L; PACKING: Tape & Reel (TR); Process Type: SM; Unit: PCS; Value: 5.1K; CATEGORY: RES SMD
R59 R60 = Res0.3: RES 22 OHM 5% 1/10W 0603; MANUFACTURER1: Yageo; MANUFACTURER1_PART#: RC0603JR-0722RL; MANUFACTURER2_PART#: RMCF0603JT22R0; PACKING: Tape & Reel (TR); Process Type: SM; Unit: PCS; Power: 0.25W; Value: 22R; CATEGORY: RES SMD; MANUFACTURER2: Stackpole Electronics Inc; Tolerance: 5%
R119 R124 = Res0.3: RES SMD,10K OHM 5% 1/10W 0603; MANUFACTURER1: Stackpole Electronics Inc; MANUFACTURER1_PART#: RMCF0603JT10K0; MANUFACTURER2_PART#: R0603J10KKDX; DESCCRIPTION: RES 10K OHM 5% 1/10W 0603; PACKING: Tape & Reel (TR); Process Type: SM; Unit: PCS; LOH_Code: 140100118; Power: 0.25W; don vi cung cap: shop; Value: 10K; CATEGORY: RES-SMD; MANUFACTURER2: UWA; Tolerance: ±5%; DESCRIPTION_: RES 10K OHM 5% 1/10W 0603
R127 R128 = Res0.3: RES SMD 0.05 OHM 1% 1W 2512; MANUFACTURER1: TE Connectivity Passive Product; MANUFACTURER1_PART#: TLRP3A30CR050FTE; PACKING: Tape & Reel (TR); Process Type: SM; Unit: PCS; CATEGORY: RES SMD; MANUFACTURER2_PART#: https://banlinhkien.com/tro-2512-1-r0500.05r-1w-p6652906.html
U4 = IC_TPS54302DDCR: IC REG BUCK ADJ 3A TSOT23-6,TPS54302DDCR; DISTR1_PART#: 296-46237-1-ND; BY: VINFAST_RD; DISTR1: DIGIKEY; MFG1: Texas Instruments; PROCESS: SM; Category: IC; MFG1_PART#: TPS54302DDCR; TYPE: IC; VFCODE: TPS54302DDCR; MANUFACTURER1: Texas Instruments; MANUFACTURER1_PART#: TPS54302DDCR
U8 = LM358: IC OPAMP GP 2 CIRCUIT 8SOIC; MANUFACTURER1_PART#: LM358BAIDR; MANUFACTURER1: Texas Instruments; MANUFACTURER2_PART#: LM358DR2G; UNIT: PCS; VALUE: LM358BAIDR; CATEGORY: IC; MANUFACTURER2: ON Semiconductor; NI_MARK: *; PROCESS_TYPE: *